# Altium schematic sheet ScaleMaker.SCHDOC
size B; Organization: Altium Limited; Address1: L3, 12a Rodborough Rd; Address2: Frenchs Forest; Address3: NSW; Address4: Australia 2086; DocumentNumber: 7; SheetNumber: 7; SheetTotal: 9
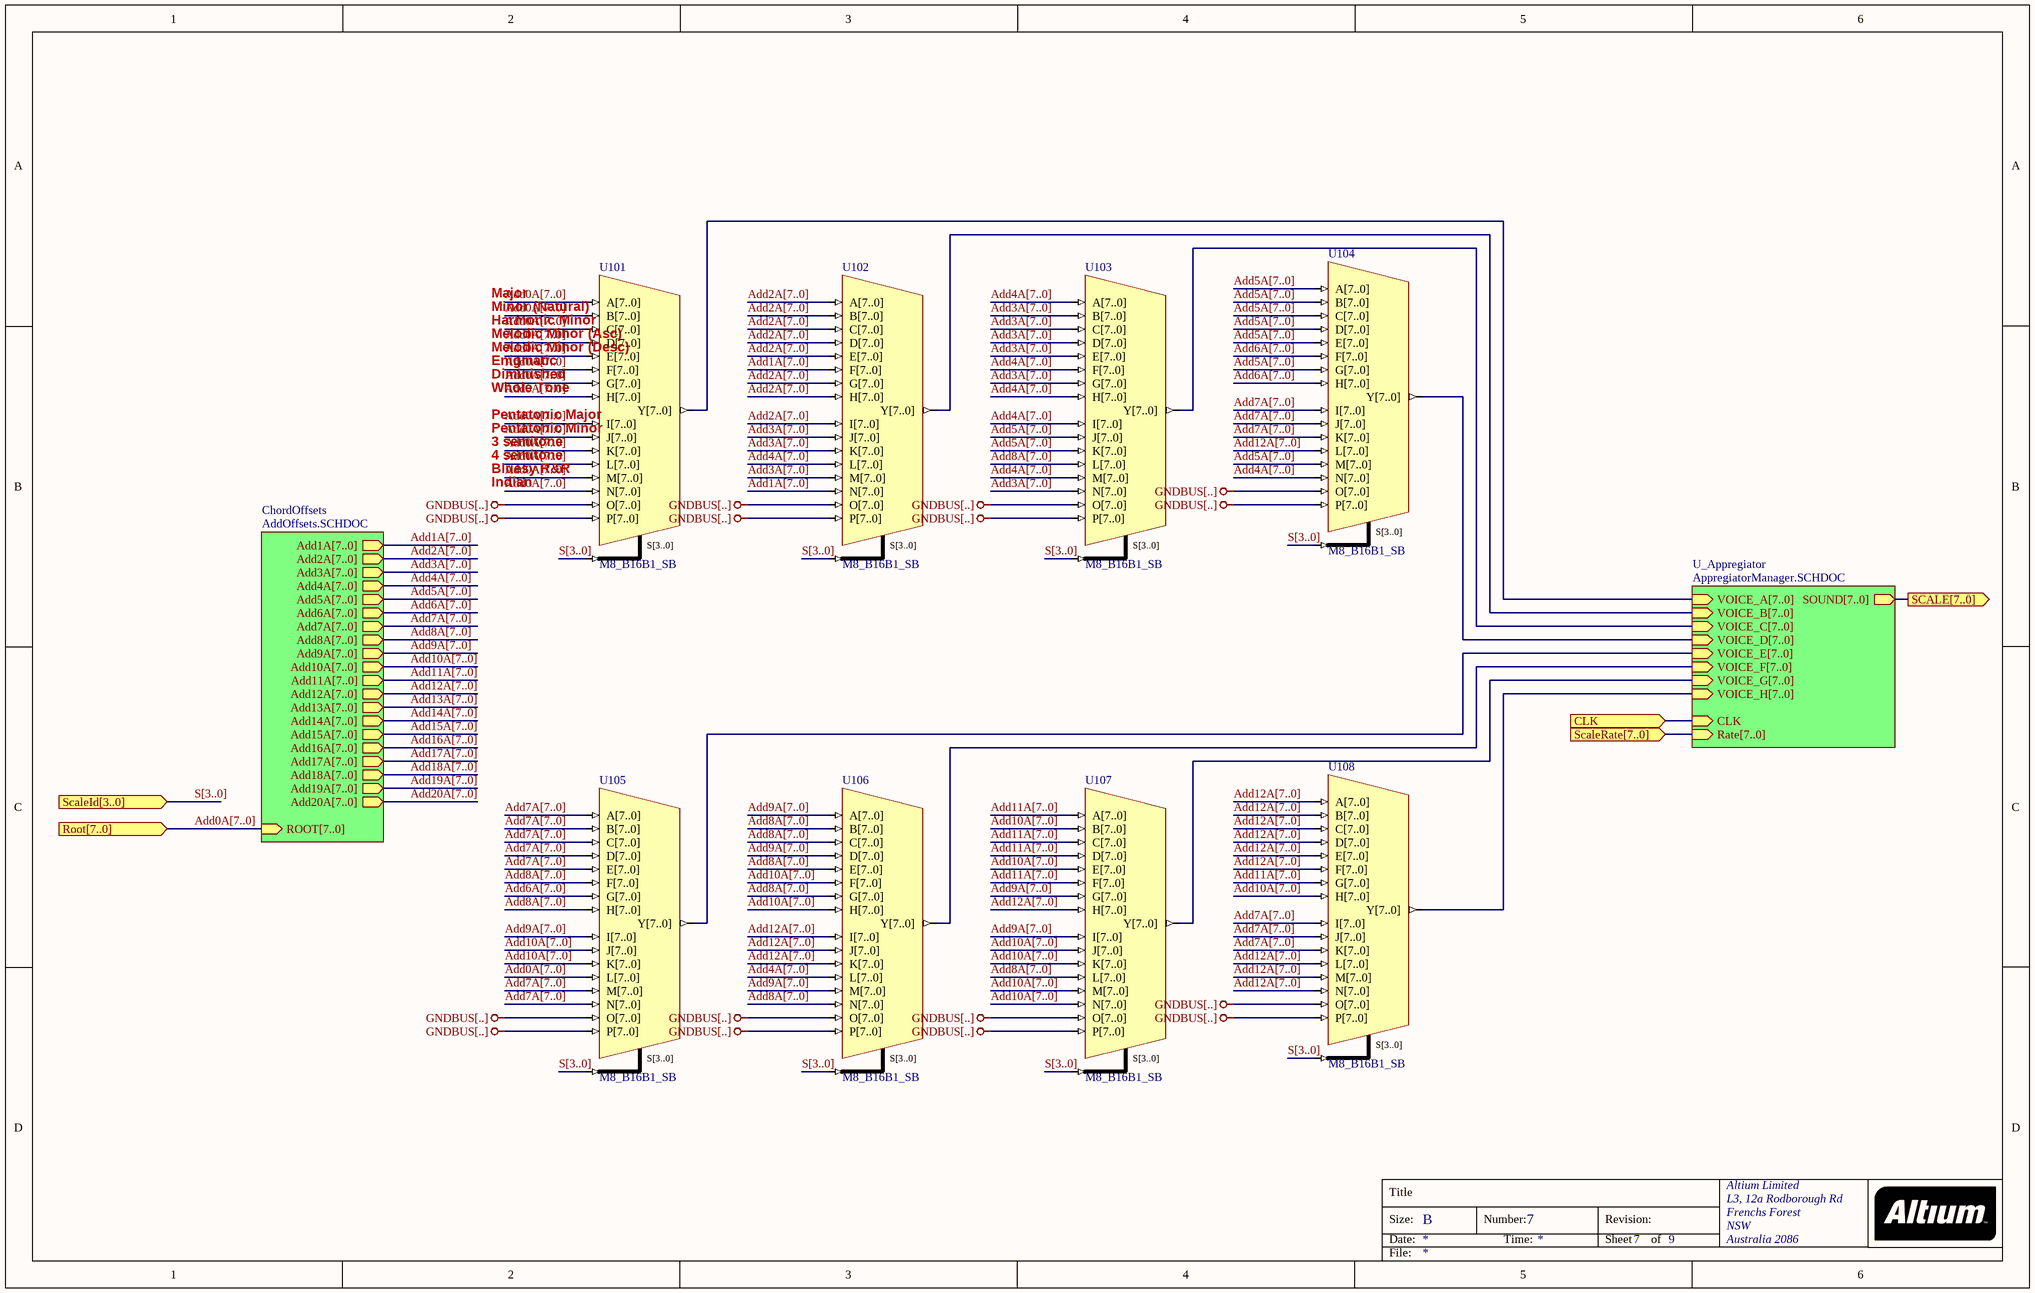
[diagram p0: ScaleMaker.SCHDOC]

## Parts
U101  M8_B16B1_SB
U102  M8_B16B1_SB
U103  M8_B16B1_SB
U104  M8_B16B1_SB
U105  M8_B16B1_SB
U106  M8_B16B1_SB
U107  M8_B16B1_SB
U108  M8_B16B1_SB

## Sub-sheets
ChordOffsets = AddOffsets.SCHDOC: ROOT[7..0] (in), Add1A[7..0] (out), Add3A[7..0] (out), Add2A[7..0] (out), Add4A[7..0] (out), Add11A[7..0] (out), Add5A[7..0] (out), Add9A[7..0] (out), Add7A[7..0] (out), Add8A[7..0] (out), Add6A[7..0] (out), Add12A[7..0] (out), Add10A[7..0] (out), Add14A[7..0] (out), Add17A[7..0] (out), Add13A[7..0] (out), Add15A[7..0] (out), Add16A[7..0] (out), Add19A[7..0] (out), Add18A[7..0] (out), Add20A[7..0] (out)
U_Appregiator = AppregiatorManager.SCHDOC: SOUND[7..0] (out), VOICE_A[7..0] (in), VOICE_B[7..0] (in), VOICE_C[7..0] (in), VOICE_D[7..0] (in), VOICE_E[7..0] (in), VOICE_H[7..0] (in), VOICE_F[7..0] (in), VOICE_G[7..0] (in), Rate[7..0] (in), CLK (in)

## Ports
CLK (in), Root[7..0] (in), SCALE[7..0] (out), ScaleId[3..0] (in), ScaleRate[7..0] (in)

## Nets
GNDBUS[..]: U101.O[7..0] U101.P[7..0] U102.O[7..0] U102.P[7..0] U103.O[7..0] U103.P[7..0] U104.O[7..0] U104.P[7..0] U105.O[7..0] U105.P[7..0] U106.O[7..0] U106.P[7..0] U107.O[7..0] U107.P[7..0] U108.O[7..0] U108.P[7..0]
Add0A[7..0]: U101.A[7..0] U101.B[7..0] U101.C[7..0] U101.D[7..0] U101.E[7..0] U101.F[7..0] U101.G[7..0] U101.H[7..0] U101.I[7..0] U101.J[7..0] U101.K[7..0] U101.L[7..0] U101.M[7..0] U101.N[7..0] U105.L[7..0] ; port Root[7..0], sheet ChordOffsets/ROOT[7..0]
Add1A[7..0]: U102.F[7..0] U102.N[7..0] ; sheet ChordOffsets/Add1A[7..0]
Add2A[7..0]: U102.A[7..0] U102.B[7..0] U102.C[7..0] U102.D[7..0] U102.E[7..0] U102.G[7..0] U102.H[7..0] U102.I[7..0] ; sheet ChordOffsets/Add2A[7..0]
Add3A[7..0]: U102.J[7..0] U102.K[7..0] U102.M[7..0] U103.B[7..0] U103.C[7..0] U103.D[7..0] U103.E[7..0] U103.G[7..0] U103.N[7..0] ; sheet ChordOffsets/Add3A[7..0]
Add4A[7..0]: U102.L[7..0] U103.A[7..0] U103.F[7..0] U103.H[7..0] U103.I[7..0] U103.M[7..0] U104.N[7..0] U106.L[7..0] ; sheet ChordOffsets/Add4A[7..0]
Add5A[7..0]: U103.J[7..0] U103.K[7..0] U104.A[7..0] U104.B[7..0] U104.C[7..0] U104.D[7..0] U104.E[7..0] U104.G[7..0] U104.M[7..0] ; sheet ChordOffsets/Add5A[7..0]
Add6A[7..0]: U104.F[7..0] U104.H[7..0] U105.G[7..0] ; sheet ChordOffsets/Add6A[7..0]
Add7A[7..0]: U104.I[7..0] U104.J[7..0] U104.K[7..0] U105.A[7..0] U105.B[7..0] U105.C[7..0] U105.D[7..0] U105.E[7..0] U105.M[7..0] U105.N[7..0] U108.I[7..0] U108.J[7..0] U108.K[7..0] ; sheet ChordOffsets/Add7A[7..0]
Add8A[7..0]: U103.L[7..0] U105.F[7..0] U105.H[7..0] U106.B[7..0] U106.C[7..0] U106.E[7..0] U106.G[7..0] U106.N[7..0] U107.L[7..0] ; sheet ChordOffsets/Add8A[7..0]
Add9A[7..0]: U105.I[7..0] U106.A[7..0] U106.D[7..0] U106.M[7..0] U107.G[7..0] U107.I[7..0] ; sheet ChordOffsets/Add9A[7..0]
Add10A[7..0]: U105.J[7..0] U105.K[7..0] U106.F[7..0] U106.H[7..0] U107.B[7..0] U107.E[7..0] U107.J[7..0] U107.K[7..0] U107.M[7..0] U107.N[7..0] U108.H[7..0] ; sheet ChordOffsets/Add10A[7..0]
Add11A[7..0]: U107.A[7..0] U107.C[7..0] U107.D[7..0] U107.F[7..0] U108.G[7..0] ; sheet ChordOffsets/Add11A[7..0]
Add12A[7..0]: U104.L[7..0] U106.I[7..0] U106.J[7..0] U106.K[7..0] U107.H[7..0] U108.A[7..0] U108.B[7..0] U108.C[7..0] U108.D[7..0] U108.E[7..0] U108.F[7..0] U108.L[7..0] U108.M[7..0] U108.N[7..0] ; sheet ChordOffsets/Add12A[7..0]
CLK: port CLK, sheet U_Appregiator/CLK
S[3..0]: U101.S[3..0] U102.S[3..0] U103.S[3..0] U104.S[3..0] U105.S[3..0] U106.S[3..0] U107.S[3..0] U108.S[3..0] ; port ScaleId[3..0]
NetU101_Y[7..0]: U101.Y[7..0] ; sheet U_Appregiator/VOICE_A[7..0]
NetU102_Y[7..0]: U102.Y[7..0] ; sheet U_Appregiator/VOICE_B[7..0]
NetU103_Y[7..0]: U103.Y[7..0] ; sheet U_Appregiator/VOICE_C[7..0]
NetU104_Y[7..0]: U104.Y[7..0] ; sheet U_Appregiator/VOICE_D[7..0]
NetU105_Y[7..0]: U105.Y[7..0] ; sheet U_Appregiator/VOICE_E[7..0]
NetU106_Y[7..0]: U106.Y[7..0] ; sheet U_Appregiator/VOICE_F[7..0]
NetU107_Y[7..0]: U107.Y[7..0] ; sheet U_Appregiator/VOICE_G[7..0]
NetU108_Y[7..0]: U108.Y[7..0] ; sheet U_Appregiator/VOICE_H[7..0]

## Buses and harness runs
bus Add0A[7..0]
bus Add0A[7..0] = port Root[7..0] = sheet ChordOffsets/ROOT[7..0]
bus Add1A[7..0]
bus Add1A[7..0] = sheet ChordOffsets/Add1A[7..0]
bus Add2A[7..0]
bus Add2A[7..0] = sheet ChordOffsets/Add2A[7..0]
bus Add3A[7..0]
bus Add3A[7..0] = sheet ChordOffsets/Add3A[7..0]
bus Add4A[7..0]
bus Add4A[7..0] = sheet ChordOffsets/Add4A[7..0]
bus Add5A[7..0]
bus Add5A[7..0] = sheet ChordOffsets/Add5A[7..0]
bus Add6A[7..0]
bus Add6A[7..0] = sheet ChordOffsets/Add6A[7..0]
bus Add7A[7..0]
bus Add7A[7..0] = sheet ChordOffsets/Add7A[7..0]
bus Add8A[7..0]
bus Add8A[7..0] = sheet ChordOffsets/Add8A[7..0]
bus Add9A[7..0]
bus Add9A[7..0] = sheet ChordOffsets/Add9A[7..0]
bus Add10A[7..0]
bus Add10A[7..0] = sheet ChordOffsets/Add10A[7..0]
bus Add11A[7..0]
bus Add11A[7..0] = sheet ChordOffsets/Add11A[7..0]
bus Add12A[7..0]
bus Add12A[7..0] = sheet ChordOffsets/Add12A[7..0]
bus Add13A[7..0] = sheet ChordOffsets/Add13A[7..0]
bus Add14A[7..0] = sheet ChordOffsets/Add14A[7..0]
bus Add15A[7..0] = sheet ChordOffsets/Add15A[7..0]
bus Add16A[7..0] = sheet ChordOffsets/Add16A[7..0]
bus Add17A[7..0] = sheet ChordOffsets/Add17A[7..0]
bus Add18A[7..0] = sheet ChordOffsets/Add18A[7..0]
bus Add19A[7..0] = sheet ChordOffsets/Add19A[7..0]
bus Add20A[7..0] = sheet ChordOffsets/Add20A[7..0]
bus port SCALE[7..0] = sheet U_Appregiator/SOUND[7..0]
bus port ScaleRate[7..0] = sheet U_Appregiator/Rate[7..0]
bus S[3..0]
bus S[3..0] = port ScaleId[3..0]

## Notes on the sheet
- Major
- Melodic Minor (Desc)
- Harmonic Minor
- Melodic Minor (Asc)
- Minor (Natural)
- Enigmatic
- Diminished
- Pentatonic Major
- Pentatonic Minor
- Whole Tone
- Indian
- 3 semitone
- 4 semitone
- Bluesy R&R
- Title
- Size:
- Date:
- B
- Number:
- Time:
- Revision:
- Sheet
- of
- File:

## Library data of the parts
U101-U108 = M8_B16B1_SB: 16x8-Bit Bus to 1x8-Bit Bus Multiplexer With Bus Version Select; ArchiveName: GENERIC; Published: 18-Dec-2003; Publisher: Altium Limited; Core Revision: 1.00.00